# Altium project Front.PrjPCB (part 1 of 2)
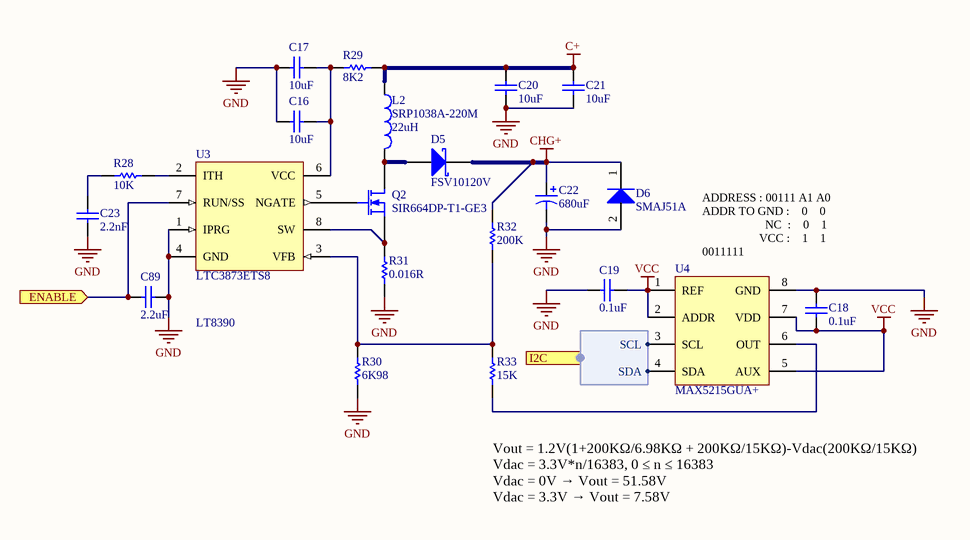
[diagram p0: Charging.SchDoc]
16 sheets, 355 parts. Net scope: hierarchical (ports join the sheet entries above them; power ports are global).
Board file: Front_2Layer.PcbDoc
Sheets:
  Charging.SchDoc
  Bluetooth.SchDoc
  Front.SchDoc
    U_3V3 = 3V3.SchDoc
    U_MCU = MCU.SchDoc
    U_Switches = Switches.SchDoc
    U_Connectors = Connectors.SchDoc
    U_CAN = CAN.SchDoc
    U_RTCC = RTCC.SchDoc
    U_Buzzer = Buzzer.SchDoc
    U_CurrentSense = CurrentSense.SchDoc
    U_LTC6803 = LTC6803.SchDoc
      12 = Cell.SchDoc
      11 = Cell.SchDoc
      10 = Cell.SchDoc
      9 = Cell.SchDoc
      8 = Cell.SchDoc
      7 = Cell.SchDoc
      6 = Cell.SchDoc
      5 = Cell.SchDoc
      4 = Cell.SchDoc
      3 = Cell.SchDoc
      2 = Cell.SchDoc
      1 = Cell.SchDoc
    U_Flash = Flash.SchDoc
    A_X = ADS1257.SchDoc
    U_USB = USB.SchDoc

## Sheet Charging.SchDoc
size A; SheetNumber: 6

### Parts
(Parts that share a designator on the sheet are numbered #1, #2 ... from top to bottom, then left to right.)
C16  value 10uF  [C0603[1608X92]]  (hidden comment: 10uF 16V 0603)
C17  value 10uF  [C0603[1608X92]]  (hidden comment: 10uF 16V 0603)
C18  value 0.1uF  [C0603[1608X92]]  (hidden comment: 0.1uF 6.3V 0603)
C19  value 0.1uF  [C0603[1608X92]]  (hidden comment: 0.1uF 6.3V 0603)
C20#1  value 10uF  [C1206[3216X160]]  (hidden comment: 10uF 50V 1206)
C21#1  value 10uF  [C1206[3216X160]]  (hidden comment: 10uF 50V 1206)
C22  value 680uF  [CAP-ELECTROLYTIC[10.0x12.6]]  (hidden comment: 180uF 50V)
C23  value 2.2nF  [C0603[1608X92]]  (hidden comment: 2.2nF 50V 0603)
C89  value 2.2uF  [C0603[1608X92]]  (hidden comment: 2.2uF 10V 0603)
D5  FSV10120V  [TO-277]
D6  SMAJ51A  [DO-214AC]
L2  SRP1038A-220M  value 22uH  [SRP1038A]
Q2  SIR664DP-T1-GE3  [PowerPak-8]
R28  value 10K  [R0603[1608]]  (hidden comment: 10K 1% 0603)
R29  value 8K2  [R0603[1608]]  (hidden comment: 8K2 1% 0603)
R30  value 6K98  [R0603[1608]]  (hidden comment: 6K98 1% 0603)
R31  value 0.016R  [R1206[3216]]  (hidden comment: 0.016R 1% 1206)
R32  value 200K  [R0603[1608]]  (hidden comment: 200K 1% 0603)
R33  value 15K  [R0603[1608]]  (hidden comment: 15K 1% 0603)
U3  LTC3873ETS8  [SOT-23-8]
U4  MAX5215GUA+  [MSOP-8]

### Ports
ENABLE (in), I2C (harness I2C)

### Harnesses
I2C: SCL, SDA

### Nets
C+: C20#1.2 C21#1.2 L2.1 R29.2
CHG+: C22.1 D5.1(K) D6.1(K) R32.2
GND: C16.1 C17.1 C18.1 C19.2 C20#1.1 C21#1.1 C22.2 C23.1 C89.2 D6.2(A) R30.1 R31.1 U3.1(IPRG) U3.4(GND) U4.8(GND)
VCC: C18.2 C19.1 U4.1(REF) U4.2(ADDR) U4.5(AUX) U4.7(VDD)
NetC16_2: C16.2 C17.2 R29.1 U3.6(VCC)
NetC23_2: C23.2 R28.1
NetC89_1: C89.1 U3.7(RUN/SS) ; port ENABLE
NetD5_2: D5.2(A) L2.2 Q2.3(D)
NetQ2_1: Q2.1(S) R31.2 U3.8(SW)
NetQ2_2: Q2.2(G) U3.5(NGATE)
NetR28_2: R28.2 U3.2(ITH)
NetR30_2: R30.2 R32.1 R33.2 U3.3(VFB)
NetR33_1: R33.1 U4.6(OUT)
NetU4_3: U4.3(SCL) ; port I2C.SCL
NetU4_4: U4.4(SDA) ; port I2C.SDA

### Notes on the sheet
- ADDRESS : 00111 A1 A0
  ADDR TO GND :    0    0
  NC  :    0    1
  VCC :    1    1
  0011111
- LT8390
- Vout = 1.2V(1+200KΩ/6.98KΩ + 200KΩ/15KΩ)-Vdac(200KΩ/15KΩ)
  Vdac = 3.3V*n/16383, 0 ≤ n ≤ 16383
  Vdac = 0V → Vout = 51.58V
  Vdac = 3.3V → Vout = 7.58V

### Library data of the parts
C16 C17 = CAP_10uF_16V_0603_10%: 10uF 16V 10% 0603 (1608 Metric); PartNumber: GRM188R61C106KAALD; Manufacturer: Murata; TemperatureCoefficient: X5R; Mounting Technology: Surface Mount; PackageReference: 0603; PackageDescription: 0603 (1608 Metric); Voltage: 16V; Tolerance: 10%
C18 C19 = CAP_0.1uF_6.3V_0603_10%: 0.1uF 6.3V 10% 0603 (1608 Metric); PartNumber: GRM188R70J104KA01D; Manufacturer: Murata; Mounting Technology: Surface Mount; PackageReference: 0603; PackageDescription: 0603 (1608 Metric); Voltage: 6.3V; Tolerance: 10%
C20#1 C21#1 = CAP_10uF_50V_1206_20%: 10uF 50V 20% 1206 (3216 Metric); PartNumber: UMK316BBJ106ML-T; Manufacturer: Taiyo Yuden; Tolerance: 20%; Mounting Technology: Surface Mount; PackageReference: 1206; PackageDescription: 1206 (3216 Metric); Voltage: 50V
C22 = CAP_180uF_50V_20%: 180uF 50V 20%; PartNumber: PCR1H181MCL1GS; Manufacturer: Nichicon; PackageReference: 1H; PackageDescription: 5mm; Mounting Technology: Surface Mount; Voltage: 50V; Tolerance: 20%
C23 = CAP_2.2nF_50V_0603_5%: 2.2nF 50V 5% 0603 (1608 Metric); PartNumber: GRM1885C1H222JA01D; Manufacturer: Murata; TemperatureCoefficient: C0G; Mounting Technology: Surface Mount; PackageReference: 0603; PackageDescription: 0603 (1608 Metric); Voltage: 50V; Tolerance: 5%
C89 = CAP_2.2uF_10V_0603_10%: 2.2uF 10V 10% 0603 (1608 Metric); PartNumber: GRT188R61A225KE13D; Manufacturer: Murata; TemperatureCoefficient: X5R; Mounting Technology: Surface Mount; PackageReference: 0603; PackageDescription: 0603 (1608 Metric); Voltage: 10V; Tolerance: 10%
D5 = FSV10120V: Schottky Diodes & Rectifiers 10 Amp 120V Schottky Rectifier; Manufacturer: Fairchild Semiconductor; PackageReference: TO-277-3; PartNumber: FSV10120V; Mounting Technology: Surface Mount
D6 = SMAJ51A-E3/61: Manufacturer: Vishay; PartNumber: SMAJ51A-E3/61; PackageReference: DO-214AC; PackageDescription: DO-214AC, 2 Leads; Mounting Technology: Surface Mount
L2 = SRP1038A-220M: 22uH 20% 7A 1038; Manufacturer: Bourns; PackageReference: SRP1038A; PartNumber: SRP1038A-220M; Mounting Technology: Surface Mount; Current: 7A
Q2 = SIR664DP-T1-GE3: N-Channel MOSFET; Manufacturer: Vishay; PartNumber: SIR664DP-T1-GE3; Mounting Technology: Surface Mount; PackageReference: PowerPAK-8
R28 = RES_10K_0603_1%: 10K 0.25W 1% 0603 (1005 Metric); Manufacturer: Vishay / Dale; PartNumber: CRCW060310K0FKEAHP; Tolerance: 1%; Power: 0.25W; Mounting Technology: Surface Mount; PackageReference: 0603; PackageDescription: 0603 (1608 Metric); ComponentLink1Description: Datasheet; ComponentLink1URL: http://www.vishay.com/docs/20065/rcse3.pdf
R29 = RES_8K2_0603_1%: 8K2 0.25W 1% 0603 (1005 Metric); Manufacturer: Vishay; PartNumber: CRCW06038K20FKEAHP; Tolerance: 1%; Power: 0.25W; Mounting Technology: Surface Mount; PackageReference: 0603; PackageDescription: 0603 (1608 Metric); ComponentLink1Description: Datasheet; ComponentLink1URL: http://www.vishay.com/docs/20043/crcwhpe3.pdf
R30 = RES_6K98_0603_1%: 6K98 0.25W 1% 0603 (1005 Metric); Manufacturer: Vishay / Dale; PartNumber: CRCW06036K98FKEAHP; Tolerance: 1%; Power: 0.25W; Mounting Technology: Surface Mount; PackageReference: 0603; PackageDescription: 0603 (1608 Metric); ComponentLink1Description: Datasheet; ComponentLink1URL: http://www.vishay.com/docs/20043/crcwhpe3.pdf
R31 = RES_0.016R_1206_1%: 0.016R 1W 1% 1206 (3216 Metric); Manufacturer: Panasonic; PartNumber: ERJ-8CWFR016V; Power: 1W; Tolerance: 1%; Mounting Technology: Surface Mount; PackageReference: 1206; PackageDescription: 1206 (3216 Metric); ComponentLink1Description: Datasheet; ComponentLink1URL: https://industrial.panasonic.com/cdbs/www-data/pdf/RDA0000/AOA0000C239.pdf
R32 = RES_200K_0603_1%: 200K 0.25W 1% 0603 (1005 Metric); Manufacturer: Rohm Semiconductor; PartNumber: ESR03EZPJ204; Tolerance: 5%; Power: 0.25W; Mounting Technology: Surface Mount; PackageReference: 0603; PackageDescription: 0603 (1608 Metric); ComponentLink1Description: Datasheet; ComponentLink1URL: http://www.vishay.com/docs/20043/crcwhpe3.pdf
R33 = RES_15K_0603_1%: 15K 0.25W 1% 0603 (1005 Metric); Manufacturer: Vishay / Dale; PartNumber: CRCW060315K0FKEAHP; Tolerance: 1%; Power: 0.25W; Mounting Technology: Surface Mount; PackageReference: 0603; PackageDescription: 0603 (1608 Metric); ComponentLink1Description: Datasheet; ComponentLink1URL: http://www.vishay.com/docs/20043/crcwhpe3.pdf
U3 = LTC3873ETS8: PartNumber: LTC3873ETS8#PBF; Manufacturer: Linear Technology; PackageReference: TSOT-23-8; Mounting Technology: Surface Mount
U4 = MAX5215GUA+: 14 Bit Digital to Analog Converter; Manufacturer: Maxim Integrated; PartNumber: MAX5215GUA+; Mounting Technology: Surface Mount; PackageReference: MSOP-8

## Sheet Bluetooth.SchDoc
size A4
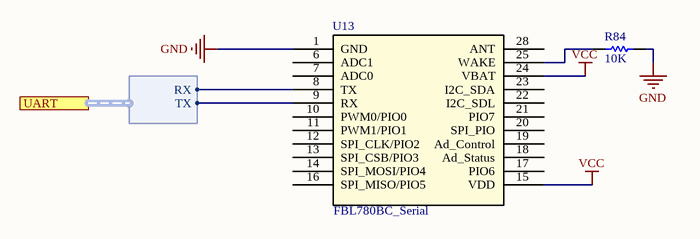
[diagram p1: Bluetooth.SchDoc]

### Parts
R84  value 10K  [R0603[1608]]  (hidden comment: 10K 1% 0603)
U13  FBL780BC_Serial  [FBL780BC_Serial]

### Ports
UART (harness USART2)

### Harnesses
USART2: TX, RX

### Nets
GND: R84.2 U13.1(GND)
VCC: U13.15(VDD) U13.24(VBAT)
NetR84_1: R84.1 U13.25(WAKE)
NetU13_8: U13.8(TX) ; port UART.RX
NetU13_9: U13.9(RX) ; port UART.TX

Not connected (* = marked no-connect by the designer): U13 6(ADC1) 7(ADC0) 10(PWM0/PIO0) 11(PWM1/PIO1) 12(SPI_CLK/PIO2) 13(SPI_CSB/PIO3) 14(SPI_MOSI/PIO4) 16(SPI_MISO/PIO5) 17(PIO6) 18(Ad_Status) 19(Ad_Control) 20(SPI_PIO) 21(PIO7) 22(I2C_SDL) 23(I2C_SDA) 28(ANT)

### Library data of the parts
R84 = RES_10K_0603_1%: as R28 on sheet Charging; Tolerance: 1%; Power: 0.25W; Mounting Technology: Surface Mount; PackageReference: 0603; PackageDescription: 0603 (1608 Metric); ComponentLink1Description: Datasheet; ComponentLink1URL: http://www.vishay.com/docs/20065/rcse3.pdf
U13 = FBL780BC_Serial: Manufacturer: Firmtech; PartNumber: FBL780BC_Serial

## Sheet Front.SchDoc
size A; SheetNumber: 1
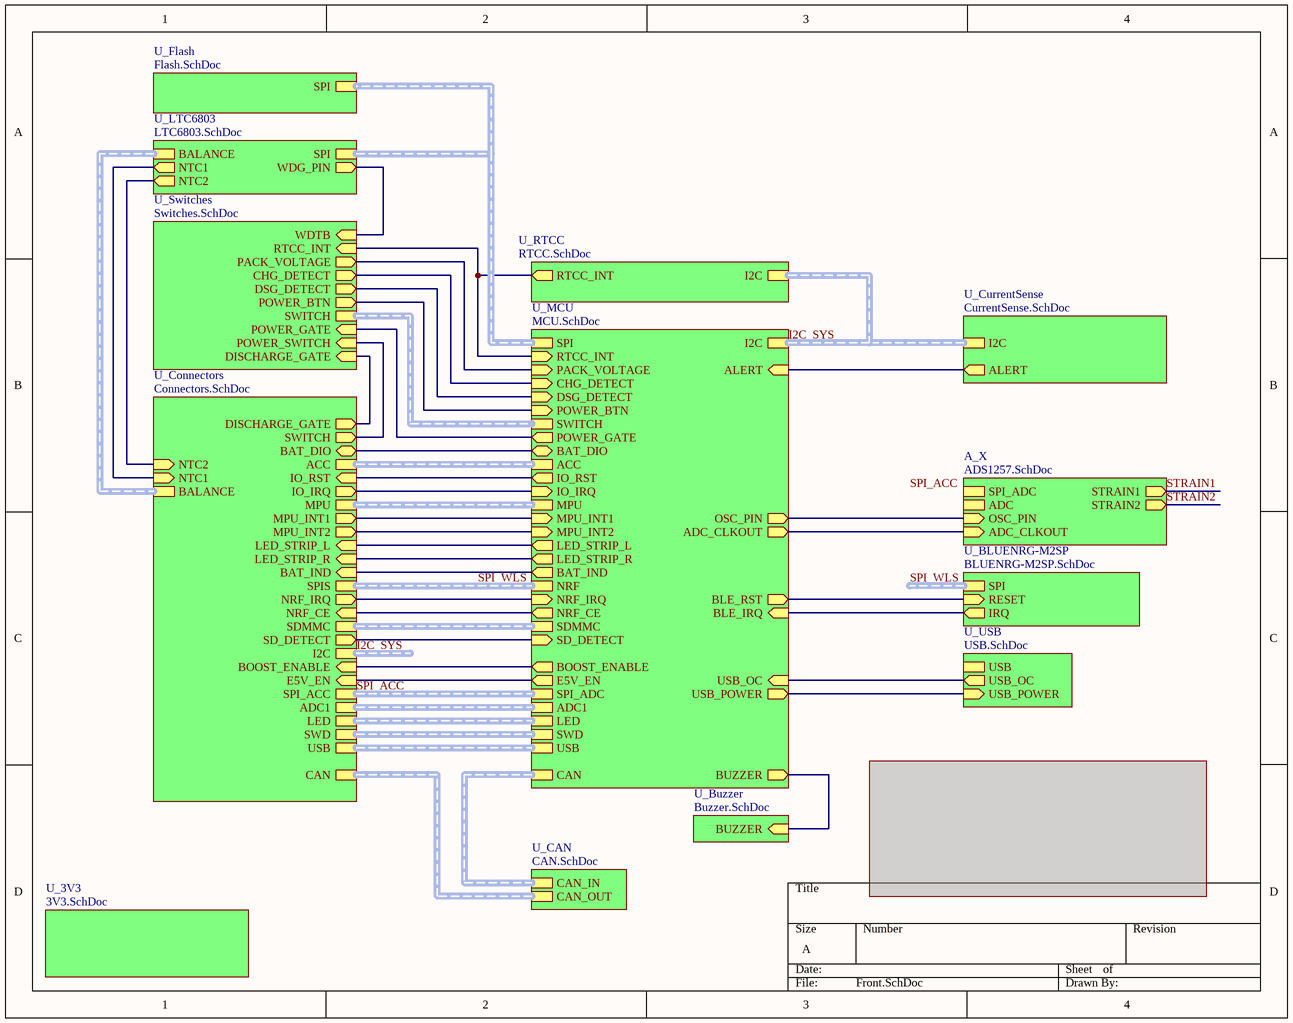
[diagram p2: Front.SchDoc]

### Sub-sheets
A_X = ADS1257.SchDoc: SPI_ADC (harness SPI_ADC), ADC (harness ADC), STRAIN1 (out), STRAIN2 (out), OSC_PIN (in), ADC_CLKOUT (in)
U_3V3 = 3V3.SchDoc: no entries
U_BLUENRG-M2SP = BLUENRG-M2SP.SchDoc (file not in this document): SPI (harness SPI), RESET (in), IRQ (out)
U_Buzzer = Buzzer.SchDoc: BUZZER (in)
U_CAN = CAN.SchDoc: CAN_IN (harness CAN Input), CAN_OUT (harness CAN Output)
U_Connectors = Connectors.SchDoc: SWITCH (out), CAN (harness CAN Output), NTC1 (in), BALANCE (harness Balance), MPU (harness I2C), MPU_INT1 (out), MPU_INT2 (out), LED_STRIP_L (in), LED_STRIP_R (in), SWD (harness SWD), LED (harness LED), IO_RST (in), IO_IRQ (out), NTC2 (in), SPIS (harness SPI), SDMMC (harness SDMMC), SD_DETECT (out), NRF_CE (in), NRF_IRQ (out), SPI_ACC (harness SPI_ADC), BAT_DIO (bidir), USB (harness USB), BAT_IND (in), DISCHARGE_GATE (out), ACC (harness I2C), BOOST_ENABLE (in), E5V_EN (in), I2C (harness I2C), ADC1 (harness ADC)
U_CurrentSense = CurrentSense.SchDoc: ALERT (out), I2C (harness I2C)
U_Flash = Flash.SchDoc: SPI (harness SPI)
U_LTC6803 = LTC6803.SchDoc: SPI (harness SPI), NTC1 (out), BALANCE (harness Balance), NTC2 (out), WDG_PIN (out)
U_MCU = MCU.SchDoc: CHG_DETECT (in), POWER_BTN (in), POWER_GATE (out), USB (harness USB), CAN (harness CAN Input), ACC (harness I2C), SWITCH (harness Switches), I2C (harness I2C), RTCC_INT (in), PACK_VOLTAGE (in), BUZZER (out), SPI_ADC (harness SPI_ADC), ADC1 (harness ADC), MPU (harness I2C), MPU_INT1 (in), MPU_INT2 (in), ALERT (in), SPI, LED_STRIP_L (out), LED_STRIP_R (out), SWD (harness SWD), LED (harness LED), IO_RST (out), IO_IRQ (in), BOOST_ENABLE (out), NRF (harness SPI), DSG_DETECT (in), SDMMC (harness SDMMC), USB_POWER (out), USB_OC (in), SD_DETECT (in), NRF_CE (out), NRF_IRQ (in), OSC_PIN (out), ADC_CLKOUT (out), BAT_DIO (bidir), BAT_IND (out), BLE_RST (out), BLE_IRQ (in), E5V_EN (out)
U_RTCC = RTCC.SchDoc: I2C (harness I2C), RTCC_INT (out)
U_Switches = Switches.SchDoc: POWER_GATE (in), POWER_BTN (out), CHG_DETECT (out), SWITCH (harness Switches), POWER_SWITCH (in), RTCC_INT (in), PACK_VOLTAGE (out), WDTB (in), DSG_DETECT (out), DISCHARGE_GATE (in)
U_USB = USB.SchDoc: USB_POWER (in), USB_OC (out), USB (harness USB)

### Nets
ADC_CLKOUT: sheet U_MCU/ADC_CLKOUT, sheet A_X/ADC_CLKOUT
ALERT: sheet U_MCU/ALERT, sheet U_CurrentSense/ALERT
BAT_DIO: sheet U_MCU/BAT_DIO, sheet U_Connectors/BAT_DIO
BAT_IND: sheet U_MCU/BAT_IND, sheet U_Connectors/BAT_IND
BLE_IRQ: sheet U_MCU/BLE_IRQ, sheet U_BLUENRG-M2SP/IRQ
BLE_RST: sheet U_MCU/BLE_RST, sheet U_BLUENRG-M2SP/RESET
BOOST: sheet U_MCU/BOOST_ENABLE, sheet U_Connectors/BOOST_ENABLE
BUZZER: sheet U_MCU/BUZZER, sheet U_Buzzer/BUZZER
CHG_DETECT: sheet U_MCU/CHG_DETECT, sheet U_Switches/CHG_DETECT
DSG_DETECT: sheet U_MCU/DSG_DETECT, sheet U_Switches/DSG_DETECT
IO_IRQ: sheet U_MCU/IO_IRQ, sheet U_Connectors/IO_IRQ
IO_RST: sheet U_MCU/IO_RST, sheet U_Connectors/IO_RST
LED_STRIP_L: sheet U_MCU/LED_STRIP_R, sheet U_Connectors/LED_STRIP_R
LED_STRIP_R: sheet U_MCU/LED_STRIP_L, sheet U_Connectors/LED_STRIP_L
MPU_INT1: sheet U_MCU/MPU_INT1, sheet U_Connectors/MPU_INT1
MPU_INT2: sheet U_MCU/MPU_INT2, sheet U_Connectors/MPU_INT2
NRF_CE: sheet U_MCU/NRF_CE, sheet U_Connectors/NRF_CE
NRF_IRQ: sheet U_MCU/NRF_IRQ, sheet U_Connectors/NRF_IRQ
OSC_PIN: sheet U_MCU/OSC_PIN, sheet A_X/OSC_PIN
POWER_GATE: sheet U_MCU/POWER_GATE, sheet U_Switches/POWER_GATE
RTCC_INT: sheet U_MCU/RTCC_INT, sheet U_Switches/RTCC_INT, sheet U_RTCC/RTCC_INT
SD_DETECT: sheet U_MCU/SD_DETECT, sheet U_Connectors/SD_DETECT
USB_OC: sheet U_MCU/USB_OC, sheet U_USB/USB_OC
USB_POWER: sheet U_MCU/USB_POWER, sheet U_USB/USB_POWER
WDTB: sheet U_Switches/WDTB, sheet U_LTC6803/WDG_PIN
NetC1_2: sheet U_Connectors/NTC1, sheet U_LTC6803/NTC1
NetC90_2: sheet U_Connectors/NTC2, sheet U_LTC6803/NTC2
NetJP4_2: sheet U_Switches/POWER_SWITCH, sheet U_Connectors/SWITCH
NetJP10_5: sheet U_MCU/E5V_EN, sheet U_Connectors/E5V_EN
NetJP21_2: sheet U_Switches/DISCHARGE_GATE, sheet U_Connectors/DISCHARGE_GATE
NetQ1_1: sheet U_MCU/POWER_BTN, sheet U_Switches/POWER_BTN
NetR22_2: sheet U_MCU/PACK_VOLTAGE, sheet U_Switches/PACK_VOLTAGE

### Buses and harness runs
harness I2C_SYS = sheet U_Connectors/I2C
harness I2C_SYS = sheet U_CurrentSense/I2C = sheet U_MCU/I2C = sheet U_RTCC/I2C
harness sheet U_CAN/CAN_IN = sheet U_MCU/CAN
harness sheet U_CAN/CAN_OUT = sheet U_Connectors/CAN
harness sheet U_Connectors/ACC = sheet U_MCU/ACC
harness sheet U_Connectors/ADC1 = sheet U_MCU/ADC1
harness sheet U_Connectors/BALANCE = sheet U_LTC6803/BALANCE
harness sheet U_Connectors/LED = sheet U_MCU/LED
harness sheet U_Connectors/MPU = sheet U_MCU/MPU
harness sheet U_Connectors/SDMMC = sheet U_MCU/SDMMC
harness sheet U_Connectors/SWD = sheet U_MCU/SWD
harness sheet U_Connectors/USB = sheet U_MCU/USB
harness sheet U_Flash/SPI = sheet U_LTC6803/SPI = sheet U_MCU/SPI
harness sheet U_MCU/SWITCH = sheet U_Switches/SWITCH
harness SPI_ACC = sheet U_Connectors/SPI_ACC = sheet U_MCU/SPI_ADC
harness SPI_WLS = sheet U_BLUENRG-M2SP/SPI
harness SPI_WLS = sheet U_Connectors/SPIS = sheet U_MCU/NRF

### Notes on the sheet
- Labels drawn without touching a wire or pin: SPI_ACC

## Sheet 3V3.SchDoc
size A; SheetNumber: 2
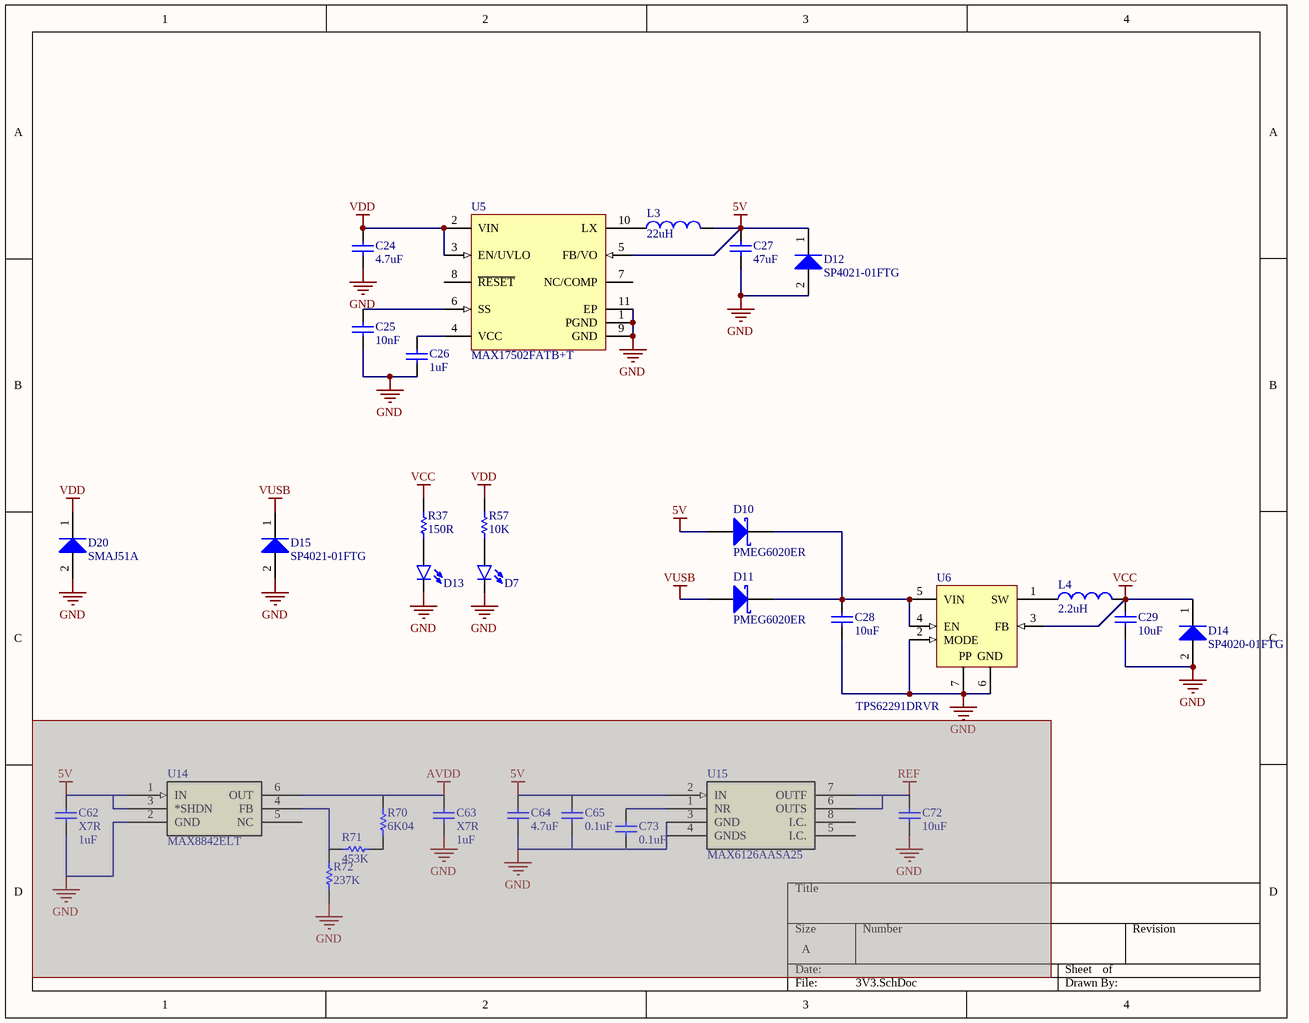
[diagram p3: 3V3.SchDoc]

### Parts
(Parts that share a designator on the sheet are numbered #1, #2 ... from top to bottom, then left to right.)
C24  value 4.7uF  [C1210[3225X200]]  (hidden comment: 4.7uF 100V 1210)
C25  value 10nF  [C0603[1608X92]]  (hidden comment: 10nF 50V 0603)
C26  value 1uF  [C0603[1608X92]]  (hidden comment: 1uF 6.3V 0603)
C27  value 47uF  [C1210[3225X250]]  (hidden comment: 47uF 6.3V 1210)
C28  value 10uF  [C0603[1608X92]]  (hidden comment: 10uF 16V 0603)
C29  value 10uF  [C0603[1608X92]]  (hidden comment: 10uF 6.3V 0603)
C62  value 1uF  TemperatureCoefficient: X7R  [C0603[1608X92]]  (hidden comment: 1uF 16V 0603 X7R)  (masked out: inside a compile mask, not in the netlist)
C63  value 1uF  TemperatureCoefficient: X7R  [C0603[1608X92]]  (hidden comment: 1uF 16V 0603 X7R)  (masked out: inside a compile mask, not in the netlist)
C64  value 4.7uF  [C0603[1608X92]]  (hidden comment: 4.7uF 16V 0603)  (masked out: inside a compile mask, not in the netlist)
C65  value 0.1uF  [C0603[1608X92]]  (hidden comment: 0.1uF 16V 0603)  (masked out: inside a compile mask, not in the netlist)
C72  value 10uF  [C0603[1608X92]]  (hidden comment: 10uF 6.3V 0603)  (masked out: inside a compile mask, not in the netlist)
C73  value 0.1uF  [C0603[1608X92]]  (hidden comment: 0.1uF 16V 0603)  (masked out: inside a compile mask, not in the netlist)
D7  LED_0603_GREEN_5mA  [LED0603]  (value not drawn)
D10  PMEG6020ER  [SOD-123]
D11  PMEG6020ER  [SOD-123]
D12  SP4021-01FTG  [SOD-323]
D13  LED_0603_GREEN_5mA  [LED0603]  (value not drawn)
D14  SP4020-01FTG  [SOD-323]
D15  SP4021-01FTG  [SOD-323]
D20  SMAJ51A  [DO-214AC]
L3  value 22uH  [0624CDMCC]  (hidden comment: 0624CDMCCDS-220MC)
L4  2.2uH  [IND0805]
R37  value 150R  [R0603[1608]]  (hidden comment: 150R 1% 0603)
R57  value 10K  [R0603[1608]]  (hidden comment: 10K 1% 0603)
R70#1  value 6K04  [R0603[1608]]  (hidden comment: 6K04 1% 0603)  (masked out: inside a compile mask, not in the netlist)
R71#1  value 453K  [R0603[1608]]  (hidden comment: 453K 1% 0603)  (masked out: inside a compile mask, not in the netlist)
R72#1  value 237K  [R0603[1608]]  (hidden comment: 237K 1% 0603)  (masked out: inside a compile mask, not in the netlist)
U5  MAX17502FATB+T  [TDFN-10-EP]
U6  TPS62291DRVR  [WSON-6]
U14  MAX8842ELT  [uDFN-6]  (masked out: inside a compile mask, not in the netlist)
U15  MAX6126AASA25  [SOIC-8]  (masked out: inside a compile mask, not in the netlist)

### Nets
5V: C27.2 D10.2(A) D12.1(K) L3.2 U5.5(FB/VO)
GND: C24.1 C25.1 C26.1 C27.1 C28.1 C29.1 D7.C D12.2(A) D13.C D14.2(A) D15.2(A) D20.2(A) U5.1(PGND) U5.9(GND) U5.11(EP) U6.2(MODE) U6.6(GND) U6.7(EP)
VCC: C29.2 D14.1(K) L4.2 R37.2 U6.3(FB)
VDD: C24.2 D20.1(K) R57.2 U5.2(VIN) U5.3(EN/UVLO)
VUSB: D11.2(A) D15.1(K)
NetC25_2: C25.2 U5.6(SS)
NetC26_2: C26.2 U5.4(VCC)
NetC28_2: C28.2 D10.1(K) D11.1(K) U6.4(EN) U6.5(VIN)
NetD7_A: D7.A R57.1
NetD13_A: D13.A R37.1
NetL3_1: L3.1 U5.10(LX)
NetL4_1: L4.1 U6.1(SW)

Not connected (* = marked no-connect by the designer): U5 7(NC/COMP) 8(~{RESET})

### Notes on the sheet
- (in symbol TPS62291DRVR) PP

### Library data of the parts
C24 = CAP_4.7uF_100V_1210_10%: 4.7uF 100V 10% 1210 (3225 Metric); PartNumber: GRJ32DC72A475KE11L; Manufacturer: Murata; Tolerance: 10%; Mounting Technology: Surface Mount; PackageReference: 1210; PackageDescription: 1210 (3225 Metric); Voltage: 100V
C25 = CAP_10nF_50V_0603_5%: 10nF 50V 5% 0603 (1608 Metric); PartNumber: GRM188R71H103JA01D; Manufacturer: Murata; TemperatureCoefficient: X7R; Tolerance: 5%; Mounting Technology: Surface Mount; PackageReference: 0603; PackageDescription: 0603 (1608 Metric); Voltage: 50V
C26 = CAP_1uF_6.3V_0603_10%: 1uF 6.3V 10% 0603 (1608 Metric); PartNumber: GRM188R60J105KA01D; Manufacturer: Murata; TemperatureCoefficient: X5R; Tolerance: 10%; Mounting Technology: Surface Mount; PackageReference: 0603; PackageDescription: 0603 (1608 Metric); Voltage: 6.3V
C27 = CAP_47uF_6.3V_1210_10%: 47uF 6.3V 10% 1210 (3225 Metric); PartNumber: GRM32ER70J476KE20L; Manufacturer: Murata; Tolerance: 10%; Mounting Technology: Surface Mount; PackageReference: 1210; PackageDescription: 1210 (3225 Metric); Voltage: 6.3V
C28 = CAP_10uF_16V_0603_10%: as C16 on sheet Charging; Mounting Technology: Surface Mount; PackageReference: 0603; PackageDescription: 0603 (1608 Metric); Voltage: 16V; Tolerance: 10%
C29 C72 = CAP_10uF_6.3V_0603_10%: 10uF 6.3V 10% 0603 (1608 Metric); PartNumber: GRM188R60J106KE47D; Manufacturer: Murata; TemperatureCoefficient: X5R; Mounting Technology: Surface Mount; PackageReference: 0603; PackageDescription: 0603 (1608 Metric); Voltage: 6.3V; Tolerance: 10%
C62 C63 = CAP_1uF_16V_0603_10%_X7R: 1uF 16V 10% 0603 X7R (1608 Metric); PartNumber: GCJ188R71E105KA01D; Manufacturer: Murata; Mounting Technology: Surface Mount; PackageReference: 0603; PackageDescription: 0603 (1608 Metric); Voltage: 16V; Tolerance: 10%
C64 = CAP_4.7uF_16V_0603_10%: 4.7uF 16V 10% 0603 (1608 Metric); PartNumber: GRM188R61A475KE15D; Manufacturer: Murata; TemperatureCoefficient: X5R; Mounting Technology: Surface Mount; PackageReference: 0603; PackageDescription: 0603 (1608 Metric); Voltage: 16V; Tolerance: 10%
C65 C73 = CAP_0.1uF_16V_0603_10%: 0.1uF 16V 10% 0603 (1608 Metric); PartNumber: GCM188R71C104KA37D; Manufacturer: Murata; TemperatureCoefficient: X7R; Mounting Technology: Surface Mount; PackageReference: 0603; PackageDescription: 0603 (1608 Metric); Voltage: 16V; Tolerance: 10%
D7 D13 = LED_0603_GREEN_5mA: PartNumber: LTST-C193TGKT-5A; Manufacturer: Lite-On Inc.; PackageReference: 0603; PackageDescription: 0603 (1608 Metric); Mounting Technology: Surface Mount
D10 D11 = PMEG6020ER: PartNumber: PMEG6020ER,115; Manufacturer: NXP Semiconductors; PackageReference: SOD-123W; PackageDescription: SOD, 2-Leads, Body 2.69x1.6mm; Mounting Technology: Surface Mount
D12 D15 = SP4021-01FTG: Manufacturer: Littelfuse; PartNumber: SP4021-01FTG; PackageReference: SOD-323-2; Mounting Technology: Surface Mount
D14 = SP4020-01FTG: Manufacturer: Littelfuse; PartNumber: SP4020-01FTG; PackageReference: SOD-323-2; Mounting Technology: Surface Mount
D20 = SMAJ51A-E3/61: Manufacturer: Vishay; PartNumber: SMAJ51A-E3/61; PackageReference: DO-214AC; Mounting Technology: Surface Mount; PackageDescription: DO-214AC, 2 Leads
L3 = 0624CDMCCDS-220MC: 22uH 20% 1.9A 222mOhm; Manufacturer: Sumida; PartNumber: 0624CDMCCDS-220MC; PackageReference: 0624CDMCC; Mounting Technology: Surface Mount; Current: 1.9A; DC Resistance: 222mOhm
L4 = IND_2.2uH_1.7A_0805_20%: 2.2uH 20% 1.7A 0805; PartNumber: LQM21PN2R2MGHL; Manufacturer: Murata; PackageReference: 0805; PackageDescription: 0805 (2012 metric); Value: 2.2uH; Mounting Technology: Surface Mount; Current: 1.7A
R37 = RES_150R_0603_1%: 150R 0.25W 1% 0603 (1005 Metric); Manufacturer: Vishay / Dale; PartNumber: CRCW0603150RFKEAHP; Tolerance: 1%; Power: 0.25W; Mounting Technology: Surface Mount; PackageReference: 0603; PackageDescription: 0603 (1608 Metric); ComponentLink1Description: Datasheet; ComponentLink1URL: http://www.vishay.com/docs/20043/crcwhpe3.pdf
R57 = RES_10K_0603_1%: as R28 on sheet Charging; Tolerance: 1%; Power: 0.25W; Mounting Technology: Surface Mount; PackageReference: 0603; PackageDescription: 0603 (1608 Metric); ComponentLink1Description: Datasheet; ComponentLink1URL: http://www.vishay.com/docs/20065/rcse3.pdf
R70#1 = RES_6K04_0603_1%: 6K04 0.25W 1% 0603 (1005 Metric); Manufacturer: Vishay / Dale; PartNumber: CRCW06036K04FKEAHP; Tolerance: 1%; Power: 0.25W; Mounting Technology: Surface Mount; PackageReference: 0603; PackageDescription: 0603 (1608 Metric); ComponentLink1Description: Datasheet; ComponentLink1URL: http://www.vishay.com/docs/20043/crcwhpe3.pdf
R71#1 = RES_453K_0603_1%: 453K 0.25W 1% 0603 (1005 Metric); Manufacturer: Panasonic; PartNumber: ERJ-P03F4533V; Tolerance: 1%; Power: 0.25W; Mounting Technology: Surface Mount; PackageReference: 0603; PackageDescription: 0603 (1608 Metric); ComponentLink1Description: Datasheet; ComponentLink1URL: http://www.vishay.com/docs/20043/crcwhpe3.pdf
R72#1 = RES_237K_0603_1%: 237K 0.25W 1% 0603 (1005 Metric); Manufacturer: Vishay / Dale; PartNumber: CRCW06036K04FKEAHP; Tolerance: 1%; Power: 0.25W; Mounting Technology: Surface Mount; PackageReference: 0603; PackageDescription: 0603 (1608 Metric); ComponentLink1Description: Datasheet; ComponentLink1URL: http://www.vishay.com/docs/20043/crcwhpe3.pdf
U5 = MAX17502FATB+T: Ultra-Small, High-Efficiency, Synchronous Step-Down DC-DC Converter, 4.5 to 60 V, 1 A, -40 to 125 degC, 10-Pin TDFN (T1032N+1), RoHS, Tape and Reel; Manufacturer: Maxim Integrated; Mounting Technology: Surface Mount; PartNumber: MAX17502FATB+T; PackageReference: TDFN-10-EP
U6 = TPS62291DRVR: Voltage Regulators - Switching Regulators 2.25MHz 1A Step-Down Cnvrtr 3.3V Output; Manufacturer: Texas Instruments; PartNumber: TPS62291DRVR; PackageReference: WSON-6; PackageDescription: SON, 6-Leads, Body 2x2mm, Pitch 0.65mm, Thermal Pad 1.6x1mm, TI Recommended; Mounting Technology: Surface Mount
U14 = MAX8842ELT: Ultra-Low-Noise, High PSRR, Low-Dropout, / 150mA Linear Regulators in µDFN; Manufacturer: Maxim Integrated; PartNumber: MAX8842ELT+; Value: Value; PackageReference: uDFN-6; Mounting Technology: Surface Mount
U15 = MAX6126AASA25: Ultra-High-Precision, Ultra-Low-Noise, / Series Voltage Reference; Maufacturer: MAXIM; Value: 2.5V; PartNumber: MAX6126AASA25; Mounting Technology: Surface Mount; PackageReference: 8-SOIC; PackageDescription: 8-SOIC, 8-Leads, Body 5x3.9mm

## Sheet MCU.SchDoc
size A3; SheetNumber: 3
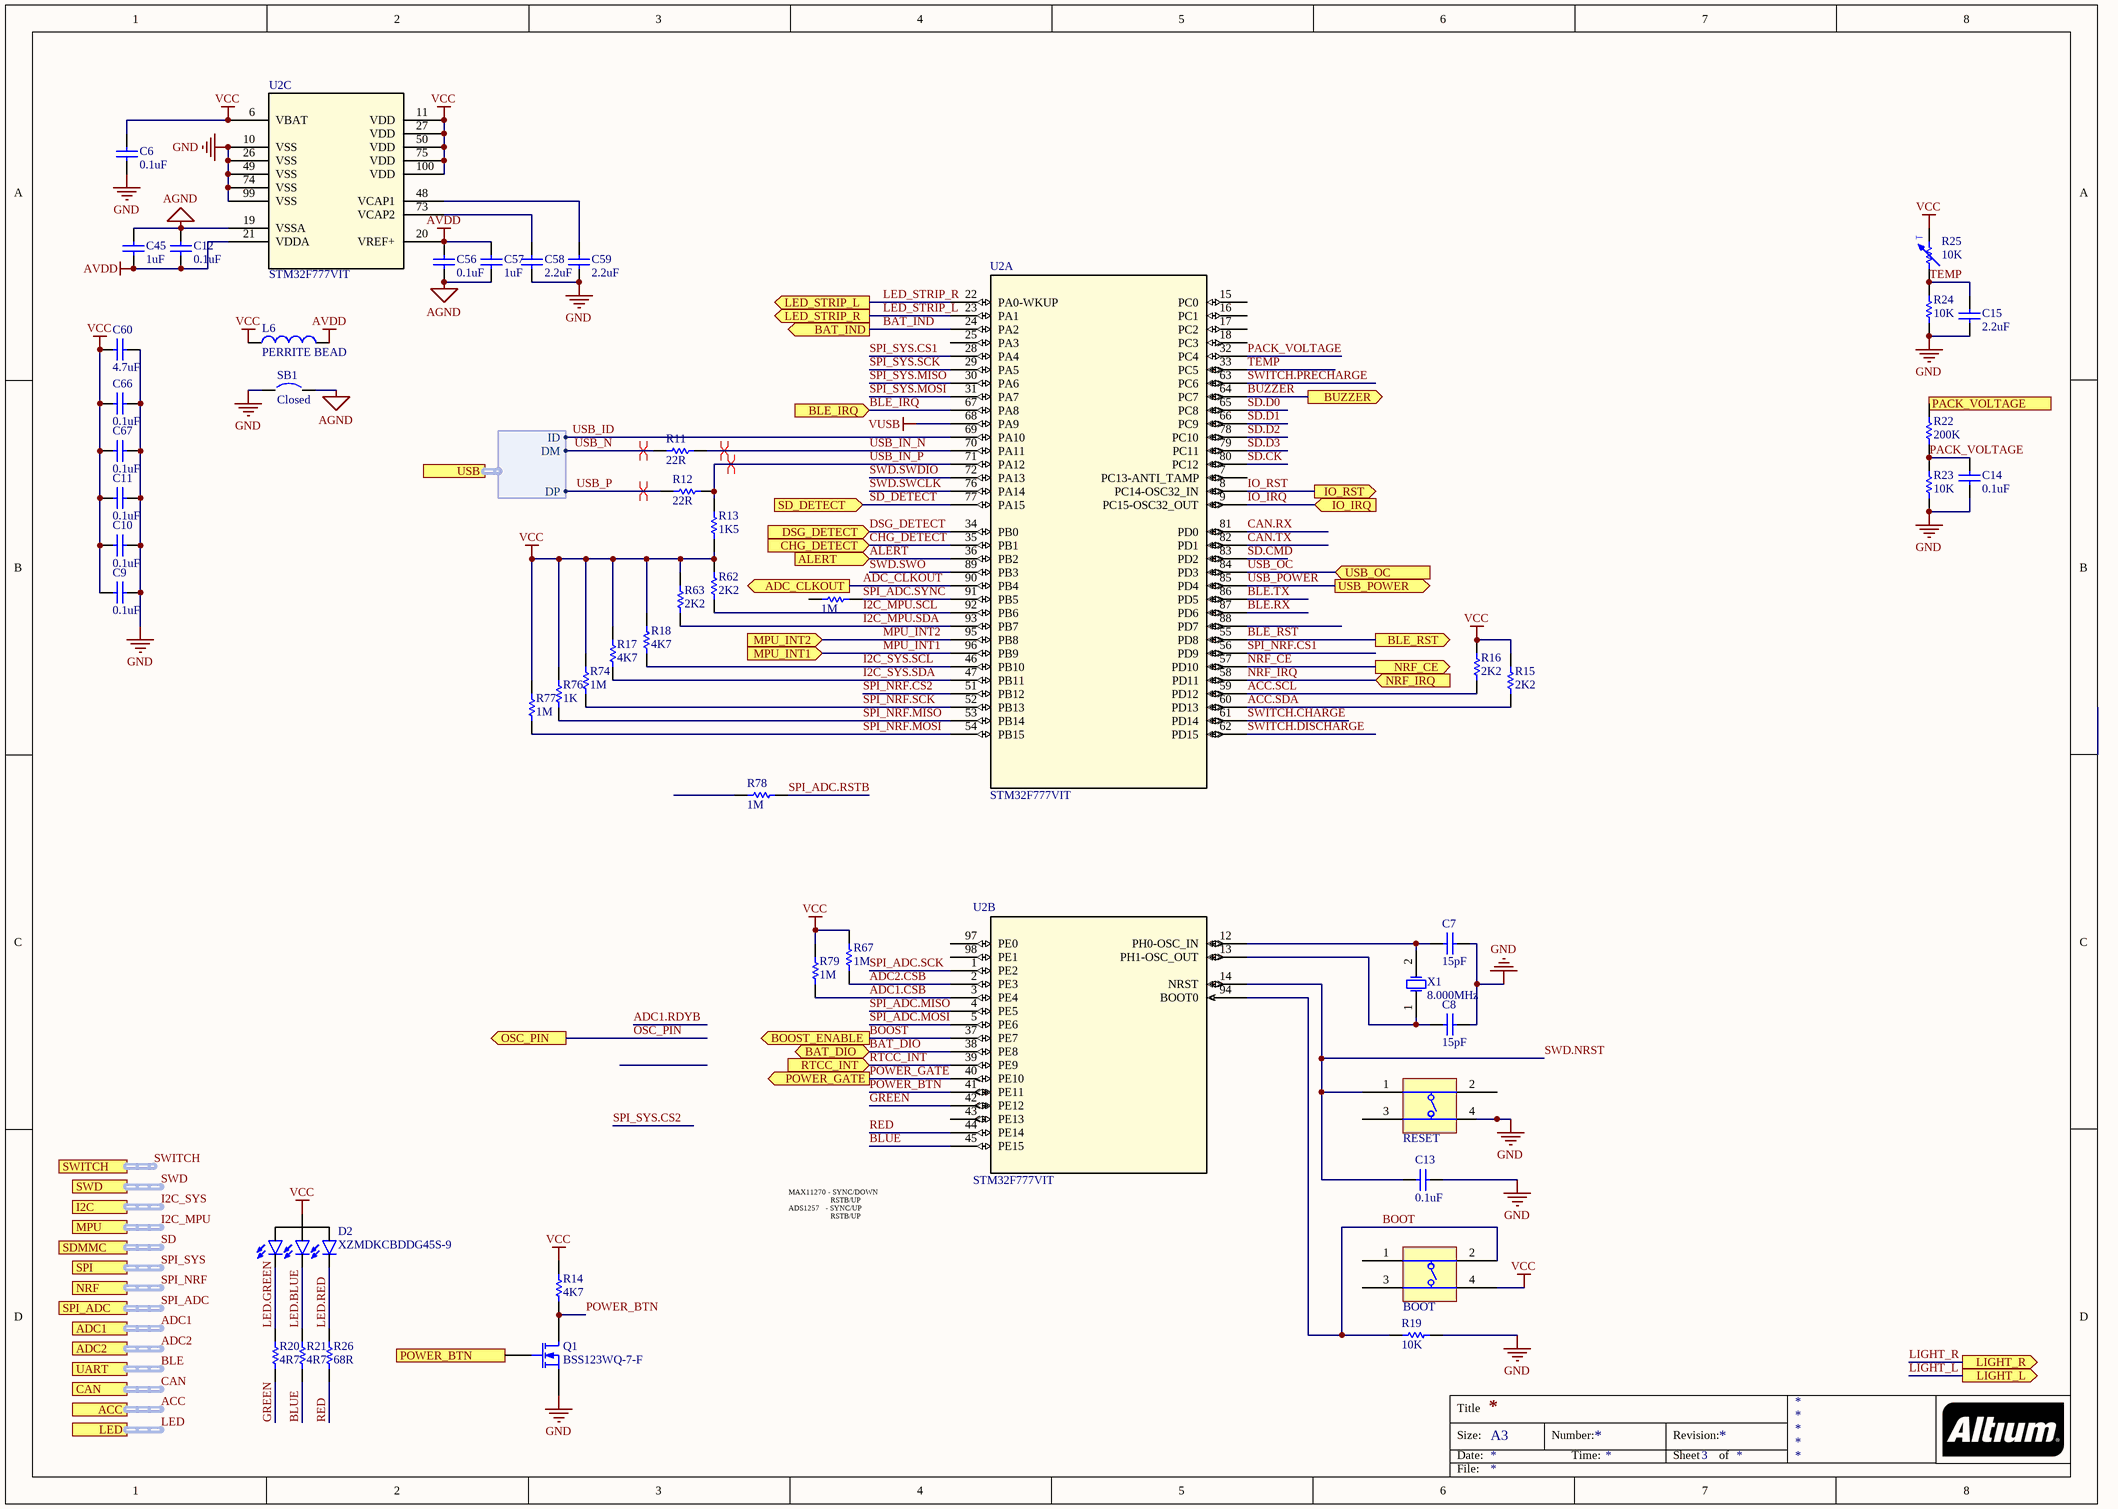
[diagram p4: MCU.SchDoc]

### Parts
(Parts that share a designator on the sheet are numbered #1, #2 ... from top to bottom, then left to right.)
BOOT  DIPT-DTSM-6  [SWITCH]  (value not drawn)
C6  value 0.1uF  [C0603[1608X92]]  (hidden comment: 0.1uF 6.3V 0603)
C7  value 15pF  [C0603[1608X92]]  (hidden comment: 15pF 50V 0603)
C8  value 15pF  [C0603[1608X92]]  (hidden comment: 15pF 50V 0603)
C9  value 0.1uF  [C0603[1608X92]]  (hidden comment: 0.1uF 6.3V 0603)
C10  value 0.1uF  [C0603[1608X92]]  (hidden comment: 0.1uF 6.3V 0603)
C11  value 0.1uF  [C0603[1608X92]]  (hidden comment: 0.1uF 6.3V 0603)
C12  value 0.1uF  [C0603[1608X92]]  (hidden comment: 0.1uF 6.3V 0603)
C13  value 0.1uF  [C0603[1608X92]]  (hidden comment: 0.1uF 6.3V 0603)
C14  value 0.1uF  [C0603[1608X92]]  (hidden comment: 0.1uF 6.3V 0603)
C15  value 2.2uF  [C0603[1608X92]]  (hidden comment: 2.2uF 6.3V 0603)
C45  value 1uF  [C0603[1608X92]]  (hidden comment: 1uF 6.3V 0603)
C56  value 0.1uF  [C0603[1608X92]]  (hidden comment: 0.1uF 6.3V 0603)
C57  value 1uF  [C0603[1608X92]]  (hidden comment: 1uF 6.3V 0603)
C58  value 2.2uF  [C1206[3216X160]]  (hidden comment: 2.2uF 16V 1206)
C59  value 2.2uF  [C1206[3216X160]]  (hidden comment: 2.2uF 16V 1206)
C60  value 4.7uF  [C0603[1608X92]]  (hidden comment: 4.7uF 6.3V 0603)
C66  value 0.1uF  [C0603[1608X92]]  (hidden comment: 0.1uF 6.3V 0603)
C67  value 0.1uF  [C0603[1608X92]]  (hidden comment: 0.1uF 6.3V 0603)
D2  XZMDKCBDDG45S-9  [XZMDKCBDDG45S-9]
L6#1  Type: PERRITE BEAD  [IND0603]  (hidden comment: 33Ohm)
Q1  BSS123WQ-7-F  [SOT323-3]
R11  value 22R  [R0603[1608]]  (hidden comment: 22R 1% 0603)
R12  value 22R  [R0603[1608]]  (hidden comment: 22R 1% 0603)
R13  value 1K5  [R0603[1608]]  (hidden comment: 1K5 1% 0603)
R14  value 4K7  [R0603[1608]]  (hidden comment: 4K7 1% 0603)
R15  value 2K2  [R0603[1608]]  (hidden comment: 2K2 1% 0603)
R16  value 2K2  [R0603[1608]]  (hidden comment: 2K2 1% 0603)
R17  value 4K7  [R0603[1608]]  (hidden comment: 4K7 1% 0603)
R18  value 4K7  [R0603[1608]]  (hidden comment: 4K7 1% 0603)
R19  value 10K  [R0603[1608]]  (hidden comment: 10K 1% 0603)
R20  value 4R7  [R0603[1608]]  (hidden comment: 4R7 5% 0603)
R21  value 4R7  [R0603[1608]]  (hidden comment: 4R7 5% 0603)
R22  value 200K  [R0603[1608]]  (hidden comment: 200K 1% 0603)
R23  value 10K  [R0603[1608]]  (hidden comment: 10K 1% 0603)
R24  value 10K  [R0603[1608]]  (hidden comment: 10K 1% 0603)
R25  value 10K  [R0603[1608]]  (hidden comment: 10K 0.5% 0603)
R26  value 68R  [R0603[1608]]  (hidden comment: 68R 1% 0603)
R62  value 2K2  [R0603[1608]]  (hidden comment: 2K2 1% 0603)
R63  value 2K2  [R0603[1608]]  (hidden comment: 2K2 1% 0603)
R67  value 1M  [R0603[1608]]  (hidden comment: 1M 5% 0603)
R74  value 1M  [R0603[1608]]  (hidden comment: 1M 5% 0603)
R75  value 1M  [R0603[1608]]  (hidden comment: 1M 5% 0603)
R76  value 1K  [R0603[1608]]  (hidden comment: 1K 1% 0603)
R77  value 1M  [R0603[1608]]  (hidden comment: 1M 5% 0603)
R78  value 1M  [R0603[1608]]  (hidden comment: 1M 5% 0603)
R79  value 1M  [R0603[1608]]  (hidden comment: 1M 5% 0603)
RESET  DIPT-DTSM-6  [SWITCH]  (value not drawn)
SB1  Closed  [SB_0603]
U2  STM32F777VIT  [LQFP-100_14X14mm]  (parts A,B,C of 3)
X1  8.000MHz  [OSC_2SM_3R2x2R5]

### Ports
ACC (harness Accessory Outputs), ADC1 (harness ADC), ADC2 (harness ADC), ADC_CLKOUT (out), ALERT (in), BAT_DIO (bidir), BAT_IND (out), BLE_IRQ (in), BLE_RST (out), BOOST_ENABLE (out), BUZZER (out), CAN (harness CAN Input), CHG_DETECT (in), DSG_DETECT (in), I2C (harness I2C), IO_IRQ (in), IO_RST (out), LED (harness LED), LED_STRIP_L (out), LED_STRIP_R (out), LIGHT_L (out), LIGHT_R (out), MPU (harness I2C), MPU_INT1 (in), MPU_INT2 (in), NRF (harness SPI), NRF_CE (out), NRF_IRQ (in), OSC_PIN (out), PACK_VOLTAGE (in), POWER_BTN (in), POWER_GATE (out), RTCC_INT (in), SD_DETECT (in), SDMMC (harness SDMMC), SPI (harness SPI), SPI_ADC (harness SPI_ADC), SWD (harness SWD), SWITCH (harness Switches), UART (harness USART2), USB (harness USB), USB_OC (in), USB_POWER (out)

### Harnesses
USB: DM, DP, ID

### Nets
AGND: C12.2 C45.2 C56.1 C57.1 SB1.2 U2.19(VSSA)
AVDD: C12.1 C45.1 C56.2 C57.2 L6#1.2 U2.20(VREF+) U2.21(VDDA)
GND: C6.1 C7.2 C8.2 C9.2 C10.2 C11.2 C13.2 C14.1 C15.1 C58.1 C59.1 C60.2 C66.2 C67.2 Q1.2(S) R19.2 R23.1 R24.1 RESET.4 SB1.1 U2.10(VSS) U2.26(VSS) U2.49(VSS) U2.74(VSS) U2.99(VSS)
VCC: BOOT.4 C6.2 C9.1 C10.1 C11.1 C60.1 C66.1 C67.1 D2.2(A) L6#1.1 R13.1 R14.2 R15.1 R16.1 R17.2 R18.2 R25.2 R62.1 R63.1 R67.1 R74.1 R76.1 R77.1 R79.1 U2.6(VBAT) U2.11(VDD) U2.27(VDD) U2.50(VDD) U2.75(VDD) U2.100(VDD)
VUSB: U2.68(PA9)
ACC.SCL: R16.2 U2.59(PD12)
ACC.SDA: R15.2 U2.60(PD13)
ADC1.CSB: R79.2 U2.3(PE4)
ADC2.CSB: R67.2 U2.2(PE3)
ADC_CLKOUT: U2.90(PB4) ; port ADC_CLKOUT
ALERT: U2.36(PB2) ; port ALERT
BAT_DIO: U2.38(PE8) ; port BAT_DIO
BAT_IND: U2.24(PA2) ; port BAT_IND
BLE.RX: U2.87(PD6)
BLE.TX: U2.86(PD5)
BLE_IRQ: U2.67(PA8) ; port BLE_IRQ
BLE_RST: U2.55(PD8) ; port BLE_RST
BLUE: R21.1 U2.45(PE15)
BOOST: U2.37(PE7) ; port BOOST_ENABLE
BOOT: BOOT.2 R19.1 U2.94(BOOT0)
BUZZER: U2.64(PC7) ; port BUZZER
CAN.RX: U2.81(PD0)
CAN.TX: U2.82(PD1)
CHG_DETECT: U2.35(PB1) ; port CHG_DETECT
DSG_DETECT: U2.34(PB0) ; port DSG_DETECT
GREEN: R20.1 U2.42(PE12)
I2C_MPU.SCL: R62.2 U2.92(PB6)
I2C_MPU.SDA: R63.2 U2.93(PB7)
I2C_SYS.SCL: R18.1 U2.46(PB10)
I2C_SYS.SDA: R17.1 U2.47(PB11)
IO_IRQ: U2.9(PC15-OSC32_OUT) ; port IO_IRQ
IO_RST: U2.8(PC14-OSC32_IN) ; port IO_RST
LED.BLUE: D2.3(K_Blue) R21.2
LED.GREEN: D2.4(K_Green) R20.2
LED.RED: D2.1(K_Red) R26.2
LED_STRIP_L: U2.23(PA1) ; port LED_STRIP_R
LED_STRIP_R: U2.22(PA0-WKUP) ; port LED_STRIP_L
LIGHT_L: port LIGHT_L
LIGHT_R: port LIGHT_R
MPU_INT1: U2.96(PB9) ; port MPU_INT1
MPU_INT2: U2.95(PB8) ; port MPU_INT2
NRF_CE: U2.57(PD10) ; port NRF_CE
NRF_IRQ: U2.58(PD11) ; port NRF_IRQ
PACK_VOLTAGE: C14.2 R22.1 R23.2 U2.32(PC4)
POWER_BTN: Q1.3(D) R14.1 U2.41(PE11)
POWER_GATE: U2.40(PE10) ; port POWER_GATE
RED: R26.1 U2.44(PE14)
RTCC_INT: U2.39(PE9) ; port RTCC_INT
SD.CK: U2.80(PC12)
SD.CMD: U2.83(PD2)
SD.D0: U2.65(PC8)
SD.D1: U2.66(PC9)
SD.D2: U2.78(PC10)
SD.D3: U2.79(PC11)
SD_DETECT: U2.77(PA15) ; port SD_DETECT
SPI_ADC.MISO: U2.4(PE5)
SPI_ADC.MOSI: U2.5(PE6)
SPI_ADC.RSTB: R78.1
SPI_ADC.SCK: U2.1(PE2)
SPI_ADC.SYNC: R75.2 U2.91(PB5)
SPI_NRF.CS1: U2.56(PD9)
SPI_NRF.CS2: U2.51(PB12)
SPI_NRF.MISO: R76.2 U2.53(PB14)
SPI_NRF.MOSI: R77.2 U2.54(PB15)
SPI_NRF.SCK: R74.2 U2.52(PB13)
SPI_SYS.CS1: U2.28(PA4)
SPI_SYS.MISO: U2.30(PA6)
SPI_SYS.MOSI: U2.31(PA7)
SPI_SYS.SCK: U2.29(PA5)
SWD.NRST: C13.1 RESET.1 U2.14(NRST)
SWD.SWCLK: U2.76(PA14)
SWD.SWDIO: U2.72(PA13)
SWD.SWO: U2.89(PB3)
SWITCH.CHARGE: U2.61(PD14)
SWITCH.DISCHARGE: U2.62(PD15)
SWITCH.PRECHARGE: U2.63(PC6)
TEMP: C15.2 R24.2 R25.1 U2.33(PC5)
USB_ID: U2.69(PA10) ; port USB.ID
USB_IN_N: R11.2 U2.70(PA11)
USB_IN_P: R12.2 R13.2 U2.71(PA12)
USB_N: R11.1 ; port USB.DM
USB_OC: U2.84(PD3) ; port USB_OC
USB_P: R12.1 ; port USB.DP
USB_POWER: U2.85(PD4) ; port USB_POWER
NetC7_1: C7.1 U2.12(PH0-OSC_IN) X1.2(OSC2)
NetC8_1: C8.1 U2.13(PH1-OSC_OUT) X1.1(OSC1)
NetC58_2: C58.2 U2.73(VCAP2)
NetC59_2: C59.2 U2.48(VCAP1)
NetQ1_1: Q1.1(G) ; port POWER_BTN
NetR22_2: R22.2 ; port PACK_VOLTAGE

Not connected (* = marked no-connect by the designer): BOOT 1 3; R75 1; R78 2; RESET 2 3; U2 7(PC13-ANTI_TAMP) 15(PC0) 16(PC1) 17(PC2) 18(PC3) 25(PA3) 43(PE13) 88(PD7) 97(PE0) 98(PE1)

### Buses and harness runs
harness ACC = port ACC
harness ADC1 = port ADC1
harness ADC2 = port ADC2
harness BLE = port UART
harness CAN = port CAN
harness I2C_MPU = port MPU
harness I2C_SYS = port I2C
harness LED = port LED
harness SD = port SDMMC
harness SPI_ADC = port SPI_ADC
harness SPI_NRF = port NRF
harness SPI_SYS = port SPI
harness SWD = port SWD
harness SWITCH = port SWITCH

### Layout directives
differential pair; rule Width Constraint [Pref Width = 10mil    Min Width = 10mil    Max Width = 10mil]: USB_N
differential pair: USB_IN_N, USB_IN_P, USB_P

### Notes on the sheet
- MAX11270 - SYNC/DOWN
  RSTB/UP
  ADS1257   - SYNC/UP
  RSTB/UP
- Title
- Size:
- Date:
- A3
- Number:
- Time:
- Revision:
- Sheet
- of
- File:
- (in symbol NTC_10K_0603_0.5%) T

### Library data of the parts
BOOT RESET = DIPT-DTSM-6: Switch, SPNO Push Button SMD; Manufacturer: C&K Components; PartNumber: PTS810 SJM 250 SMTR LFS; PackageReference: PTS810
C6 C9-C14 C56 C66 C67 = CAP_0.1uF_6.3V_0603_10%: as C18 on sheet Charging; Mounting Technology: Surface Mount; PackageReference: 0603; PackageDescription: 0603 (1608 Metric); Voltage: 6.3V; Tolerance: 10%
C7 C8 = CAP_15pF_50V_0603_1%: 15pF 50V 1% 0603 (1608 Metric); PartNumber: 06035A150FAT2A; Manufacturer: AVX Corporation; TemperatureCoefficient: C0G; Mounting Technology: Surface Mount; PackageReference: 0603; PackageDescription: 0603 (1608 Metric); Voltage: 50V; Tolerance: 1%
C15 = CAP_2.2uF_6.3V_0603_10%: 2.2uF 6.3V 10% 0603 (1608 Metric); PartNumber: GRM185R60J225KE26D; Manufacturer: Murata; TemperatureCoefficient: X5R; Mounting Technology: Surface Mount; PackageReference: 0603; PackageDescription: 0603 (1608 Metric); Voltage: 6.3V; Tolerance: 10%
C45 C57 = CAP_1uF_6.3V_0603_10%: as C26 on sheet 3V3; Mounting Technology: Surface Mount; PackageReference: 0603; PackageDescription: 0603 (1608 Metric); Voltage: 6.3V; Tolerance: 10%
C58 C59 = CAP_2.2uF_16V_1206_10%: 2.2uF 16V 10% X7R 1206 (3216 Metric); PartNumber: C1206C225K4RACAUTO; Manufacturer: KEMET; Mounting Technology: Surface Mount; PackageReference: 1206; PackageDescription: 1206 (3216 Metric); Voltage: 16V; Tolerance: 10%
C60 = CAP_4.7uF_6.3V_0603_10%: 4.7uF 6.3V 10% 0603 (1608 Metric); PartNumber: GRM188R60J475KE19J; Manufacturer: Murata; TemperatureCoefficient: X5R; Mounting Technology: Surface Mount; PackageReference: 0603; PackageDescription: 0603 (1608 Metric); Voltage: 6.3V; Tolerance: 10%
D2 = XZMDKCBDDG45S-9: Manufacturer: SunLED; PartNumber: XZMDKCBDDG45S-9; PackageReference: 4-PLCC; Mounting Technology: Surface Mount; PackageDescription: 4-SMD, Gull Wing,  3.20mm L x 2.80mm W
L6#1 = PER_33Ohm_3A_0603: 33Ohm 3A 0603 Perrite Bead; Manufacturer: Murata; PartNumber: BLM18PG330SN1D; PackageReference: 0603; PackageDescription: 0603 (1608 metric); Mounting Technology: Surface Mount; Current: 3A; Value: 33Ohm
Q1 = BSS123WQ-7-F: N-Channel MOSFET; Manufacturer: Diodes Incorporated; PackageReference: SOT-323-3; PartNumber: BSS123WQ-7-F; Mounting Technology: Surface Mount
R11 R12 = RES_22R_0603_1%: 22R 0.25W 1% 0603 (1005 Metric); Manufacturer: Vishay / Dale; PartNumber: CRCW060322R0FKEAHP; Tolerance: 1%; Power: 0.25W; Mounting Technology: Surface Mount; PackageReference: 0603; PackageDescription: 0603 (1608 Metric); ComponentLink1Description: Datasheet; ComponentLink1URL: http://www.vishay.com/docs/20043/crcwhpe3.pdf
R13 = RES_1K5_0603_1%: 1K5 0.25W 1% 0603 (1005 Metric); Manufacturer: Vishay / Dale; PartNumber: CRCW06031K50FKEAHP; Tolerance: 1%; Power: 0.25W; Mounting Technology: Surface Mount; PackageReference: 0603; PackageDescription: 0603 (1608 Metric); ComponentLink1Description: Datasheet; ComponentLink1URL: http://www.vishay.com/docs/20043/crcwhpe3.pdf
R14 R17 R18 = RES_4K7_0603_1%: 4K7 0.25W 1% 0603 (1005 Metric); Manufacturer: Vishay / Dale; PartNumber: CRCW06034K70FKEAHP; Tolerance: 1%; Power: 0.25W; Mounting Technology: Surface Mount; PackageReference: 0603; PackageDescription: 0603 (1608 Metric); ComponentLink1Description: Datasheet; ComponentLink1URL: http://www.vishay.com/docs/20043/crcwhpe3.pdf
R15 R16 R62 R63 = RES_2K2_0603_1%: 2K2 0.25W 1% 0603 (1005 Metric); Manufacturer: Vishay / Dale; PartNumber: CRCW06032K20FKEAHP; Tolerance: 1%; Power: 0.25W; Mounting Technology: Surface Mount; PackageReference: 0603; PackageDescription: 0603 (1608 Metric); ComponentLink1Description: Datasheet; ComponentLink1URL: http://www.vishay.com/docs/20043/crcwhpe3.pdf
R19 R23 R24 = RES_10K_0603_1%: as R28 on sheet Charging; Tolerance: 1%; Power: 0.25W; Mounting Technology: Surface Mount; PackageReference: 0603; PackageDescription: 0603 (1608 Metric); ComponentLink1Description: Datasheet; ComponentLink1URL: http://www.vishay.com/docs/20065/rcse3.pdf
R20 R21 = RES_4R7_0603_5%: 4R7 0.25W 5% 0603 (1005 Metric); Manufacturer: Rohm; PartNumber: ESR03EZPJ4R7; Tolerance: 5%; Power: 0.25W; Mounting Technology: Surface Mount; PackageReference: 0603; PackageDescription: 0603 (1608 Metric); ComponentLink1Description: Datasheet; ComponentLink1URL: http://www.vishay.com/docs/20043/crcwhpe3.pdf
R22 = RES_200K_0603_1%: as R32 on sheet Charging; Power: 0.25W; Mounting Technology: Surface Mount; PackageReference: 0603; PackageDescription: 0603 (1608 Metric); ComponentLink1Description: Datasheet; ComponentLink1URL: http://www.vishay.com/docs/20043/crcwhpe3.pdf
R25 = NTC_10K_0603_0.5%: NTC 10K 0.5% 0603 (1608 Metric); PartNumber: NCP18XH103D60RC; Manufacturer: Murata; Power: 0.1W; Mounting Technology: Surface Mount; PackageReference: 0603; PackageDescription: 0603 (1608 Metric); Tolerance: 0.5%
R26 = RES_68R_0603_1%: 68R 0.25W 1% 0603 (1005 Metric); Manufacturer: Panasonic; PartNumber: ERJ-PA3F68R0V; Tolerance: 1%; Power: 0.25W; Mounting Technology: Surface Mount; PackageReference: 0603; PackageDescription: 0603 (1608 Metric); ComponentLink1Description: Datasheet; ComponentLink1URL: http://www.vishay.com/docs/20043/crcwhpe3.pdf
R67 R74 R75 R77-R79 = RES_1M_0603_5%: 1M 0.25W 5% 0603 (1005 Metric); Manufacturer: Panasonic; PartNumber: ERJ-PA3J105V; Tolerance: 5%; Power: 0.25W; Mounting Technology: Surface Mount; PackageReference: 0603; PackageDescription: 0603 (1608 Metric); ComponentLink1Description: Datasheet; ComponentLink1URL: http://www.vishay.com/docs/20043/crcwhpe3.pdf
R76 = RES_1K_0603_1%: 1K 0.25W 1% 0603 (1005 Metric); Manufacturer: Vishay / Dale; PartNumber: CRCW06031K00FKEAHP; Tolerance: 1%; Power: 0.25W; Mounting Technology: Surface Mount; PackageReference: 0603; PackageDescription: 0603 (1608 Metric); ComponentLink1Description: Datasheet; ComponentLink1URL: http://www.vishay.com/docs/20043/crcwhpe3.pdf
SB1 = Circuit Breaker_close: Circuit Breaker; Published: 24-Mar-1999; Revision: July-2002: Re-released for DXP Platform.; Publisher: Altium Limited
U2 = STM32F777VIT: Imported; Manufacturer: STMicroelectronics; Value: Value; Type: Type; RefDes: RefDes; PartNumber: STM32F777VIT
X1 = XTAL_NX3225GD_8MHZ: Crystal Oscillator; Manufacturer: NX; PartNumber: NX3225GD-8MHZ-STD-CRA-3; PackageReference: 2-SMD; Value: 8.000MHz

## Sheet Switches.SchDoc
size A; SheetNumber: 7
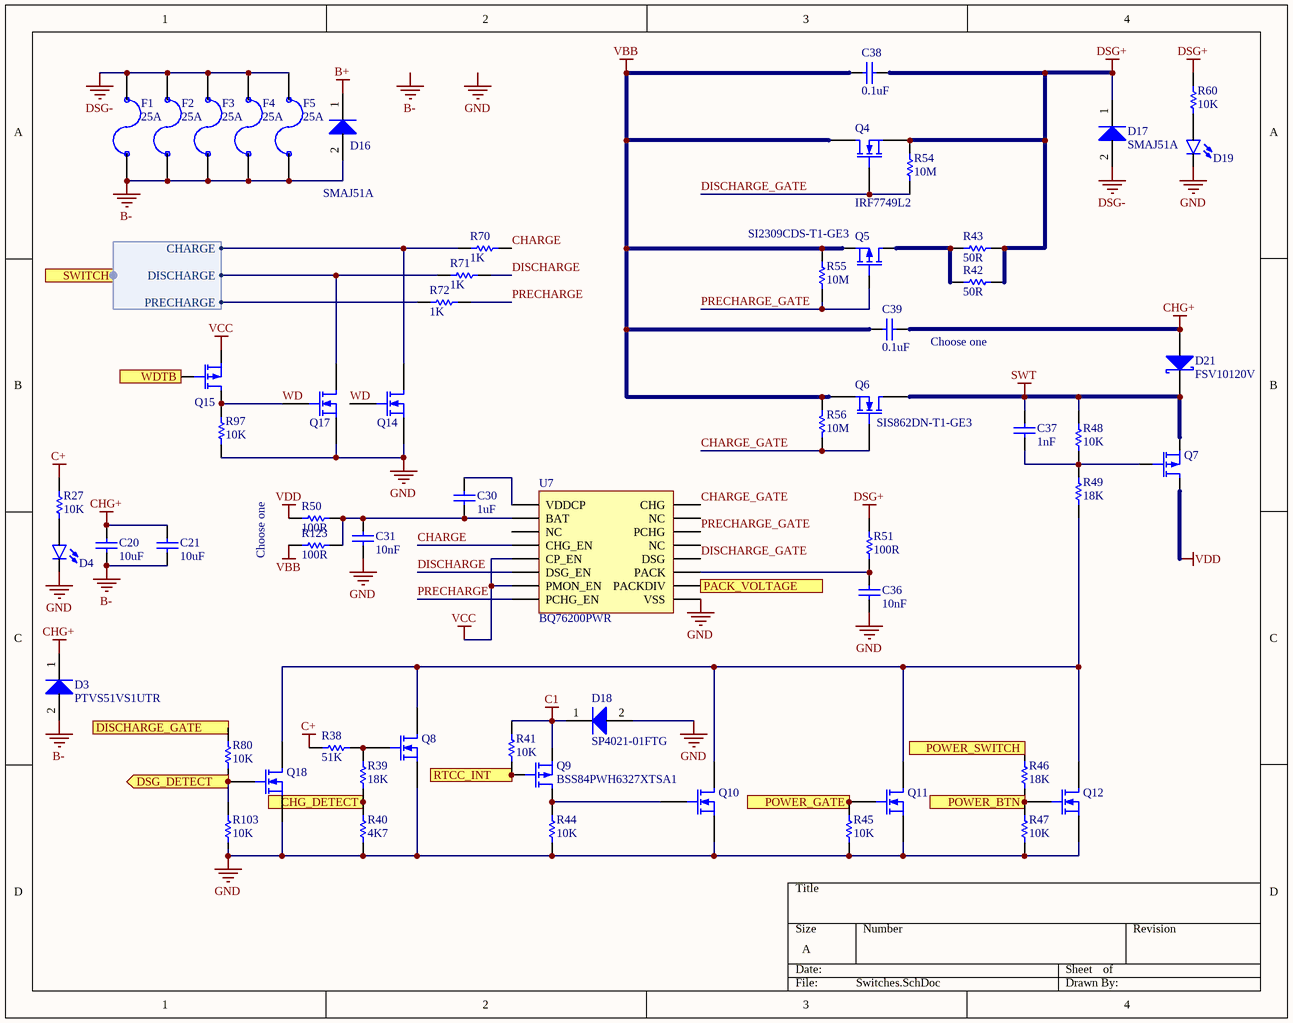
[diagram p5: Switches.SchDoc]

### Parts
(Parts that share a designator on the sheet are numbered #1, #2 ... from top to bottom, then left to right.)
C20#2  value 10uF  [C1206[3216X160]]  (hidden comment: 10uF 50V 1206)
C21#2  value 10uF  [C1206[3216X160]]  (hidden comment: 10uF 50V 1206)
C30  value 1uF  [C0603[1608X92]]  (hidden comment: 1uF 50V 0603)
C31  value 10nF  [C0603[1608X92]]  (hidden comment: 10nF 100V 0603)
C36  value 10nF  [C0603[1608X92]]  (hidden comment: 10nF 100V 0603)
C37  value 1nF  [C0603[1608X92]]  (hidden comment: 1nF 50V 0603)
C38  value 0.1uF  [C0603[1608X92]]  (hidden comment: 0.1uF 100V 0603)
C39  value 0.1uF  [C0603[1608X92]]  (hidden comment: 0.1uF 100V 0603)
D3  PTVS51VS1UTR  [SOD-123W]
D4  LED_0603_GREEN_5mA  [LED0603]  (value not drawn)
D16  SMAJ51A  [DO-214AC]
D17  SMAJ51A  [DO-214AC]
D18  SP4021-01FTG  [SOD-323]
D19  LED_0603_GREEN_5mA  [LED0603]  (value not drawn)
D21  FSV10120V  [TO-277]
F1  Current: 25A  [1206_FUSE]  (hidden comment: FUSE 1206)
F2  Current: 25A  [1206_FUSE]  (hidden comment: FUSE 1206)
F3  Current: 25A  [1206_FUSE]  (hidden comment: FUSE 1206)
F4  Current: 25A  [1206_FUSE]  (hidden comment: FUSE 1206)
F5  Current: 25A  [1206_FUSE]  (hidden comment: FUSE 1206)
Q4  IRF7749L2  [DIRECTFET-9]
Q5  SI2309CDS-T1-GE3  [SOT23-3]
Q6  SIS862DN-T1-GE3  [PowerPak-1212-8]
Q7  SQ7415AEN-T1-GE3  [PowerPak-1212-8]  (value not drawn)
Q8  BSS123WQ-7-F  [SOT323-3]  (value not drawn)
Q9  BSS84PWH6327XTSA1  [SOT323-3]
Q10  BSS123WQ-7-F  [SOT323-3]  (value not drawn)
Q11  BSS123WQ-7-F  [SOT323-3]  (value not drawn)
Q12  BSS123WQ-7-F  [SOT323-3]  (value not drawn)
Q14  BSS123WQ-7-F  [SOT323-3]  (value not drawn)
Q15  BSS84PWH6327XTSA1  [SOT323-3]  (value not drawn)
Q17  BSS123WQ-7-F  [SOT323-3]  (value not drawn)
Q18  BSS123WQ-7-F  [SOT323-3]  (value not drawn)
R27  value 10K  [R0603[1608]]  (hidden comment: 10K 1% 0603)
R38  value 51K  [R0603[1608]]  (hidden comment: 51K 1% 0603)
R39  value 18K  [R0603[1608]]  (hidden comment: 18K 1% 0603)
R40  value 4K7  [R0603[1608]]  (hidden comment: 4K7 1% 0603)
R41  value 10K  [R0603[1608]]  (hidden comment: 10K 1% 0603)
R42  value 50R  [R1206[3216]]  (hidden comment: 50R 2% 1206)
R43  value 50R  [R1206[3216]]  (hidden comment: 50R 2% 1206)
R44  value 10K  [R0603[1608]]  (hidden comment: 10K 1% 0603)
R45  value 10K  [R0603[1608]]  (hidden comment: 10K 1% 0603)
R46  value 18K  [R0603[1608]]  (hidden comment: 18K 1% 0603)
R47  value 10K  [R0603[1608]]  (hidden comment: 10K 1% 0603)
R48  value 10K  [R0603[1608]]  (hidden comment: 10K 1% 0603)
R49  value 18K  [R0603[1608]]  (hidden comment: 18K 1% 0603)
R50  value 100R  [R0603[1608]]  (hidden comment: 100R 1% 0603)
R51  value 100R  [R0603[1608]]  (hidden comment: 100R 1% 0603)
R54  value 10M  [R0603[1608]]  (hidden comment: 10M 1% 0603)
R55  value 10M  [R0603[1608]]  (hidden comment: 10M 1% 0603)
R56  value 10M  [R0603[1608]]  (hidden comment: 10M 1% 0603)
R60  value 10K  [R0603[1608]]  (hidden comment: 10K 1% 0603)
R70#2  value 1K  [R0603[1608]]  (hidden comment: 1K 1% 0603)
R71#2  value 1K  [R0603[1608]]  (hidden comment: 1K 1% 0603)
R72#2  value 1K  [R0603[1608]]  (hidden comment: 1K 1% 0603)
R80  value 10K  [R0603[1608]]  (hidden comment: 10K 1% 0603)
R97  value 10K  [R0603[1608]]  (hidden comment: 10K 1% 0603)
R103  value 10K  [R0603[1608]]  (hidden comment: 10K 1% 0603)
R123  value 100R  [R0603[1608]]  (hidden comment: 100R 1% 0603)
U7  BQ76200PWR  [TSSOP-16]

### Ports
CHG_DETECT (out), DISCHARGE_GATE (in), DSG_DETECT (out), PACK_VOLTAGE (out), POWER_BTN (out), POWER_GATE (in), POWER_SWITCH (in), RTCC_INT (in), SWITCH (harness Switches), WDTB (in)

### Harnesses
Switches: CHARGE, DISCHARGE, PRECHARGE

### Nets
B+: D16.1(K)
B-: C20#2.1 C21#2.1 D3.2(A) D16.2(A) F1.2 F2.2 F3.2 F4.2 F5.2
C1: D18.1(K) Q9.2(S) R41.1
C+: R27.2 R38.2
CHG+: C20#2.2 C21#2.2 C39.2 D3.1(K) D21.2(A)
DSG+: C38.2 D17.1(K) Q4.2(S) R42.2 R43.2 R51.2 R54.2 R60.2
DSG-: D17.2(A) F1.1 F2.1 F3.1 F4.1 F5.1
GND: C31.1 C36.1 D4.C D18.2(A) D19.C Q8.2(S) Q10.2(S) Q11.2(S) Q12.2(S) Q14.2(S) Q17.2(S) Q18.2(S) R40.1 R44.1 R45.1 R47.1 R97.1 R103.1 U7.9(VSS)
SWT: C37.2 D21.1(K) Q6.3(D) Q7.1(S) R48.2
VBB: C38.1 C39.1 Q4.3(D) Q5.3(S) Q6.1(S) R55.2 R56.2 R123.1
VCC: Q15.2(S) U7.5(CP_EN) U7.7(PMON_EN)
VDD: Q7.3(D) R50.1
CHARGE: R70#2.1 U7.4(CHG_EN)
CHARGE_GATE: Q6.2(G) R56.1 U7.16(CHG)
CHG_DETECT: R39.1 R40.2 ; port CHG_DETECT
DISCHARGE: R71#2.1 U7.6(DSG_EN)
DISCHARGE_GATE: Q4.1(G) R54.1 U7.12(DSG)
DSG_DETECT: Q18.1(G) R80.1 R103.2 ; port DSG_DETECT
POWER_GATE: Q11.1(G) R45.2 ; port POWER_GATE
PRECHARGE: R72#2.1 U7.8(PCHG_EN)
PRECHARGE_GATE: Q5.1(G) R55.1 U7.14(PCHG)
RTCC_INT: Q9.1(G) R41.2 ; port RTCC_INT
SWITCH.CHARGE: Q14.3(D) R70#2.2 ; port SWITCH.CHARGE
SWITCH.DISCHARGE: Q17.3(D) R71#2.2 ; port SWITCH.DISCHARGE
SWITCH.PRECHARGE: R72#2.2 ; port SWITCH.PRECHARGE
WD: Q14.1(G) Q15.3(D) Q17.1(G) R97.2
WDTB: Q15.1(G) ; port WDTB
NetC30_1: C30.1 C31.2 R50.2 R123.2 U7.2(BAT)
NetC30_2: C30.2 U7.1(VDDCP)
NetC36_2: C36.2 R51.1 U7.11(PACK)
NetC37_1: C37.1 Q7.2(G) R48.1 R49.2
NetD4_A: D4.A R27.1
NetD19_A: D19.A R60.1
NetJP4_2: R46.2 ; port POWER_SWITCH
NetJP21_2: R80.2 ; port DISCHARGE_GATE
NetQ1_1: Q12.1(G) R46.1 R47.2 ; port POWER_BTN
NetQ5_2: Q5.2(D) R42.1 R43.1
NetQ8_1: Q8.1(G) R38.1 R39.2
NetQ8_3: Q8.3(D) Q10.3(D) Q11.3(D) Q12.3(D) Q18.3(D) R49.1
NetQ9_3: Q9.3(D) Q10.1(G) R44.2
NetR22_2: U7.10(PACKDIV) ; port PACK_VOLTAGE

Not connected (* = marked no-connect by the designer): U7 3(NC) 13(NC) 15(NC)

### Notes on the sheet
- Choose one
- Labels drawn without touching a wire or pin: B-, GND

### Library data of the parts
C20#2 C21#2 = CAP_10uF_50V_1206_20%: as C20#1 on sheet Charging; Tolerance: 20%; Mounting Technology: Surface Mount; PackageReference: 1206; PackageDescription: 1206 (3216 Metric); Voltage: 50V
C30 = CAP_1uF_50V_0603_10%: 1uF 50V 10% 0603 (1608 Metric); PartNumber: GRM188R61H105KAALD; Manufacturer: Murata; TemperatureCoefficient: X5R; Tolerance: 10%; Mounting Technology: Surface Mount; PackageReference: 0603; PackageDescription: 0603 (1608 Metric); Voltage: 50V
C31 C36 = CAP_10nF_100V_0603_10%: 10nF 100V 10% 0603 (1608 Metric); PartNumber: GRM188R72A103KA01D; Manufacturer: Murata; TemperatureCoefficient: X7R; Tolerance: 10%; Mounting Technology: Surface Mount; PackageReference: 0603; PackageDescription: 0603 (1608 Metric); Voltage: 100V
C37 = CAP_1nF_50V_0603_5%: 1nF 50V 5% 0603 (1608 Metric); PartNumber: GRM1885C1H102JA01D; Manufacturer: Murata; TemperatureCoefficient: C0G; Mounting Technology: Surface Mount; PackageReference: 0603; PackageDescription: 0603 (1608 Metric); Voltage: 50V; Tolerance: 5%
C38 C39 = CAP_0.1uF_100V_0603_10%: 0.1uF 100V 10% 0603 (1608 Metric); PartNumber: GRM188R72A104KA35D; Manufacturer: Murata; TemperatureCoefficient: X7R; Mounting Technology: Surface Mount; PackageReference: 0603; PackageDescription: 0603 (1608 Metric); Voltage: 100V; Tolerance: 10%
D3 = PTVS51VS1UTR,115: Manufacturer: NXP; Mounting Technology: Surface Mount; PartNumber: PTVS51VS1UTR,115; PackageReference: SOD-123W; PackageDescription: SOD123W, 2-Leads
D4 D19 = LED_0603_GREEN_5mA: as D7 on sheet 3V3; PackageReference: 0603; PackageDescription: 0603 (1608 Metric); Mounting Technology: Surface Mount
D16 D17 = SMAJ51A-E3/61: Manufacturer: Vishay; PartNumber: SMAJ51A-E3/61; PackageReference: DO-214AC; Mounting Technology: Surface Mount; PackageDescription: DO-214AC, 2 Leads
D18 = SP4021-01FTG: Manufacturer: Littelfuse; PartNumber: SP4021-01FTG; PackageReference: SOD-323-2; Mounting Technology: Surface Mount
D21 = FSV10120V: as D5 on sheet Charging; PackageReference: TO-277-3; PartNumber: FSV10120V; Mounting Technology: Surface Mount
F1-F5 = FUSE 1206: Surface Mount Fuses UST 1206 FUSE 25A F; PartNumber: 3413.0332.22; Manufacturer: Schurter; Mounting Technology: Surface Mount; PackageReference: 1206; PackageDescription: 1206 (3216 Metric)
Q4 = IRF7749L2: N-Channel MOSFET; PartNumber: IRF7749L1TRPBF; Manufacturer: Infineon Technologies; PackageReference: DIRECTFET L8; PackageDescription: DirectFET™ Isometric L8; Mounting Technology: Surface Mount
Q5 = SI2309CDS-T1-GE3: P-Channel MOSFET; Manufacturer: Vishay; PackageReference: SOT23-3; Mounting Technology: Surface Mount; PartNumber: SI2309CDS-T1-GE3
Q6 = SIS862DN-T1-GE3: N-Channel MOSFET; Manufacturer: Vishay; PackageReference: PowerPAK-1212-8; PartNumber: SIS862DN-T1-GE3; Mounting Technology: Surface Mount
Q7 = SQ7415AEN-T1-GE3: P-Channel MOSFET; Manufacturer: Vishay; PartNumber: SQ7415AEN-T1-GE3; Mounting Technology: Surface Mount; PackageReference: PowerPAK-1212-8
Q8 Q10-Q12 Q14 Q17 Q18 = BSS123WQ-7-F: as Q1 on sheet MCU; PackageReference: SOT-323-3; PartNumber: BSS123WQ-7-F; Mounting Technology: Surface Mount
Q9 Q15 = BSS84PW H6327: P-Channel MOSFET; Manufacturer: Infineon; Mounting Technology: Surface Mount; PartNumber: BSS84PWH6327XTSA1; PackageReference: SOT323-3
R27 R41 R44 R45 R47 R48 R60 R80 R97 R103 = RES_10K_0603_1%: as R28 on sheet Charging; Power: 0.25W; Tolerance: 1%; Mounting Technology: Surface Mount; PackageReference: 0603; PackageDescription: 0603 (1608 Metric); ComponentLink1Description: Datasheet; ComponentLink1URL: http://www.vishay.com/docs/20065/rcse3.pdf
R38 = RES_51K_0603_1%: 51K 0.25W 1% 0603 (1005 Metric); Manufacturer: Panasonic; PartNumber: ERJ-PA3F5102V; Power: 0.25W; Tolerance: 1%; Mounting Technology: Surface Mount; PackageReference: 0603; PackageDescription: 0603 (1608 Metric); ComponentLink1Description: Datasheet; ComponentLink1URL: http://www.vishay.com/docs/20043/crcwhpe3.pdf
R39 R46 R49 = RES_18K_0603_1%: 18K 0.25W 1% 0603 (1005 Metric); Manufacturer: Vishay / Dale; PartNumber: CRCW060318K0FKEAHP; Tolerance: 1%; Power: 0.25W; Mounting Technology: Surface Mount; PackageReference: 0603; PackageDescription: 0603 (1608 Metric); ComponentLink1Description: Datasheet; ComponentLink1URL: http://www.vishay.com/docs/20043/crcwhpe3.pdf
R40 = RES_4K7_0603_1%: as R14 on sheet MCU; Tolerance: 1%; Power: 0.25W; Mounting Technology: Surface Mount; PackageReference: 0603; PackageDescription: 0603 (1608 Metric); ComponentLink1Description: Datasheet; ComponentLink1URL: http://www.vishay.com/docs/20043/crcwhpe3.pdf
R42 R43 = RES_50R_1206_2%: 50R 2.4W 2% 1206 (3216 Metric); Manufacturer: Vishay; PartNumber: RCP1206W50R0GEB; Tolerance: 2%; Power: 2.4W; Mounting Technology: Surface Mount; PackageReference: 1206; PackageDescription: 1206 (3216 Metric); ComponentLink1Description: Datasheet; ComponentLink1URL: http://www.vishay.com/docs/31098/rcp.pdf
R50 R51 R123 = RES_100R_0603_1%: 100R 0.25W 1% 0603 (1005 Metric); Manufacturer: Vishay / Dale; PartNumber: CRCW0603100RFKEAHP; Power: 0.25W; Tolerance: 1%; Mounting Technology: Surface Mount; PackageReference: 0603; PackageDescription: 0603 (1608 Metric); ComponentLink1Description: Datasheet; ComponentLink1URL: http://www.vishay.com/docs/20043/crcwhpe3.pdf
R54-R56 = RES_10M_0603_1%: 10M 0.25W 1% 0603 (1005 Metric); Manufacturer: Vishay / Dale; PartNumber: RCS060310M0FKEA; Tolerance: 1%; Power: 0.25W; Mounting Technology: Surface Mount; PackageReference: 0603; PackageDescription: 0603 (1608 Metric); ComponentLink1Description: Datasheet; ComponentLink1URL: http://www.vishay.com/docs/20043/crcwhpe3.pdf
R70#2 R71#2 R72#2 = RES_1K_0603_1%: as R76 on sheet MCU; Tolerance: 1%; Power: 0.25W; Mounting Technology: Surface Mount; PackageReference: 0603; PackageDescription: 0603 (1608 Metric); ComponentLink1Description: Datasheet; ComponentLink1URL: http://www.vishay.com/docs/20043/crcwhpe3.pdf
U7 = BQ76200PWR: Battery Management Fast high side NCH drive; Manufacturer: Texas Instruments; PartNumber: BQ76200PWR; PackageReference: TSSOP-16; Mounting Technology: Surface Mount